# Altium schematic sheet dcdc_na_akkum.SchDoc
size A3; Organization: Yandex; Address2: 11 Timura Frunze st., building 2; Release_Date: yyyy-mm-dd; Language: en; Organization2: Self Driving Group LLC
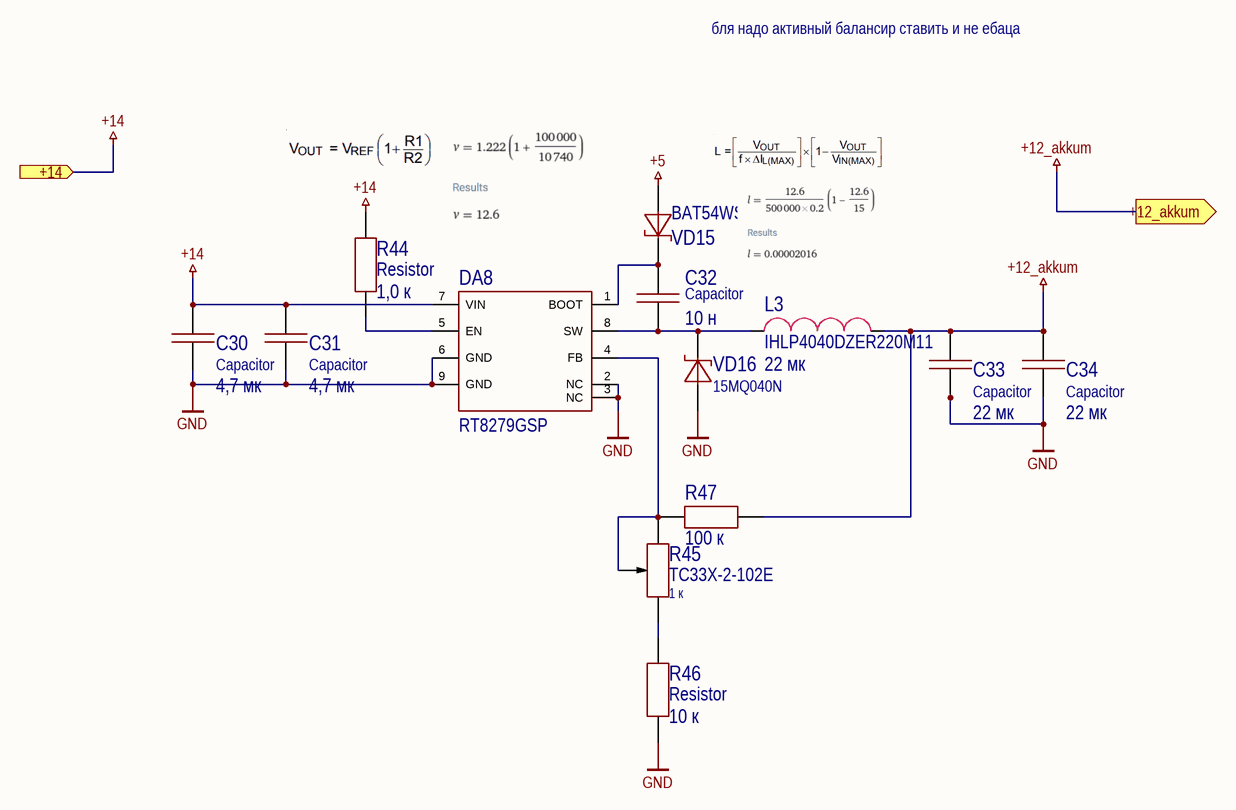
[diagram p0: dcdc_na_akkum.SchDoc]

## Parts
C30  Capacitor  value 4,7 мк  [1206C]
C31  Capacitor  value 4,7 мк  [1206C]
C32  Capacitor  value 10 н  [0603C]
C33  Capacitor  value 22 мк  [1210C]
C34  Capacitor  value 22 мк  [1210C]
DA8  RT8279GSP  [8SOP(Exposed_Pad)]
L3  IHLP4040DZER220M11  value 22 мк  [IHLP-4040]
R44  Resistor  value 1,0 к  [0603R]
R45  TC33X-2-102E  value 1 к  [3mm_trim]
R46  Resistor  value 10 к  [0603R]
R47  value 100 к  [0603R]  (hidden comment: Resistor)
VD15  BAT54WS  [SOD-323]
VD16  15MQ040N  [SMA]

## Ports
+12_akkum (out), +14 (in)

## Nets
+5: VD15.1
+12_akkum: C33.2 C34.2 L3.2 R47.2 ; port +12_akkum
+14: C30.2 C31.2 DA8.7(VIN) R44.2 ; port +14
GND: C30.1 C31.1 C33.1 C34.1 DA8.2(NC) DA8.3(NC) DA8.6(GND) DA8.9(GND) R46.1 VD16.1
NetC32_1: C32.1 DA8.8(SW) L3.1 VD16.2
NetC32_2: C32.2 DA8.1(BOOT) VD15.2
NetDA8_4: DA8.4(FB) R45.2 R45.3 R47.1
NetDA8_5: DA8.5(EN) R44.1
NetR45_1: R45.1 R46.2

## Notes on the sheet
- бля надо активный балансир ставить и не ебаца
- 1
- 2
- 3
- 4
- 5
- 6
- 7
- 8
- A
- B
- C
- D
- E
- Responsible department
- Technical reference
- Document type
- Document status
- F
- Legal owner
- Created by
- Schematic drawing
- Title, Supplementary title
- CONFIDENTIAL
- Yandex
- Commercial secret
- Self Driving Group LLC
- Approved by
- Doc Rev.
- Date of Issue
- Lang.
- Sheet
- A3

## Library data of the parts
C30 C31 = Capacitor_4,7u_10_50V_X7R_1206C: Конденсатор; Tolerance: 0,1; Voltage (V): 50; Dielectric: X7R; Capacity (nF): 4700; Part Number: Capacitor_4,7u_10_50V_X7R_1206C
C32 = Capacitor_10n_10_50V_X7R_0603C: Конденсатор; Tolerance: 0,1; Voltage (V): 50; Dielectric: X7R; Capacity (nF): 10; Part Number: Capacitor_10n_10_50V_X7R_0603C
C33 C34 = Capacitor_22u_10_25V_X7R_1210C: Конденсатор; Tolerance: 0,1; Voltage (V): 25; Dielectric: X7R; Capacity (nF): 22000; Part Number: Capacitor_22u_10_25V_X7R_1210C
DA8 = RT8279GSP: Преобразователь постоянного тока понижающий подстраиваемый выход 5А; Part Number: RT8279GSP
L3 = IHLP4040DZER220M11: ЧИП-индуктивность экранированная 22мкГн ±20% 5A 66мОм 4040 лента на катушке; Inductance (μH): 22; Current (A): 5; Part Number: IHLP4040DZER220M11
R44 = Resistor_1.0k_1_0603: Резистор номиналом 1,0 кОм и точностью 1%; Power: *; Part Number: Resistor_1.0k_1_0603; Tolerance: 1%
R45 = TC33X-2-102E: Потенциометр керметный 1кОм 0.1Вт для поверхностного монтажа; Tolerance: 50%; Part Number: TC33X-2-102E
R46 = Resistor_10k_1_0603: Резистор номиналом 10 кОм и точностью 1%; Power: *; Part Number: Resistor_10k_1_0603; Tolerance: 1%
R47 = Resistor_100k_1_0603: Резистор номиналом 100 кОм и точностью 1%; Power: *; Part Number: Resistor_100k_1_0603; Tolerance: 1%
VD15 = BAT54WS: Диод шоттки на 30 В, ном. ток 0.2 А; Voltage nominal (V): 30; Current (A): 0.2; Part Number: BAT54WS
VD16 = 15MQ040N: Диод шоттки на 40 В, ном. ток 2.1 А; Voltage nominal (V): 40; Current (A): 2.1; Part Number: 15MQ040N